# EAGLE schematic ESP Breakout Adapter - v2_0B - SPX3819 (EAGLE 7.3.0)
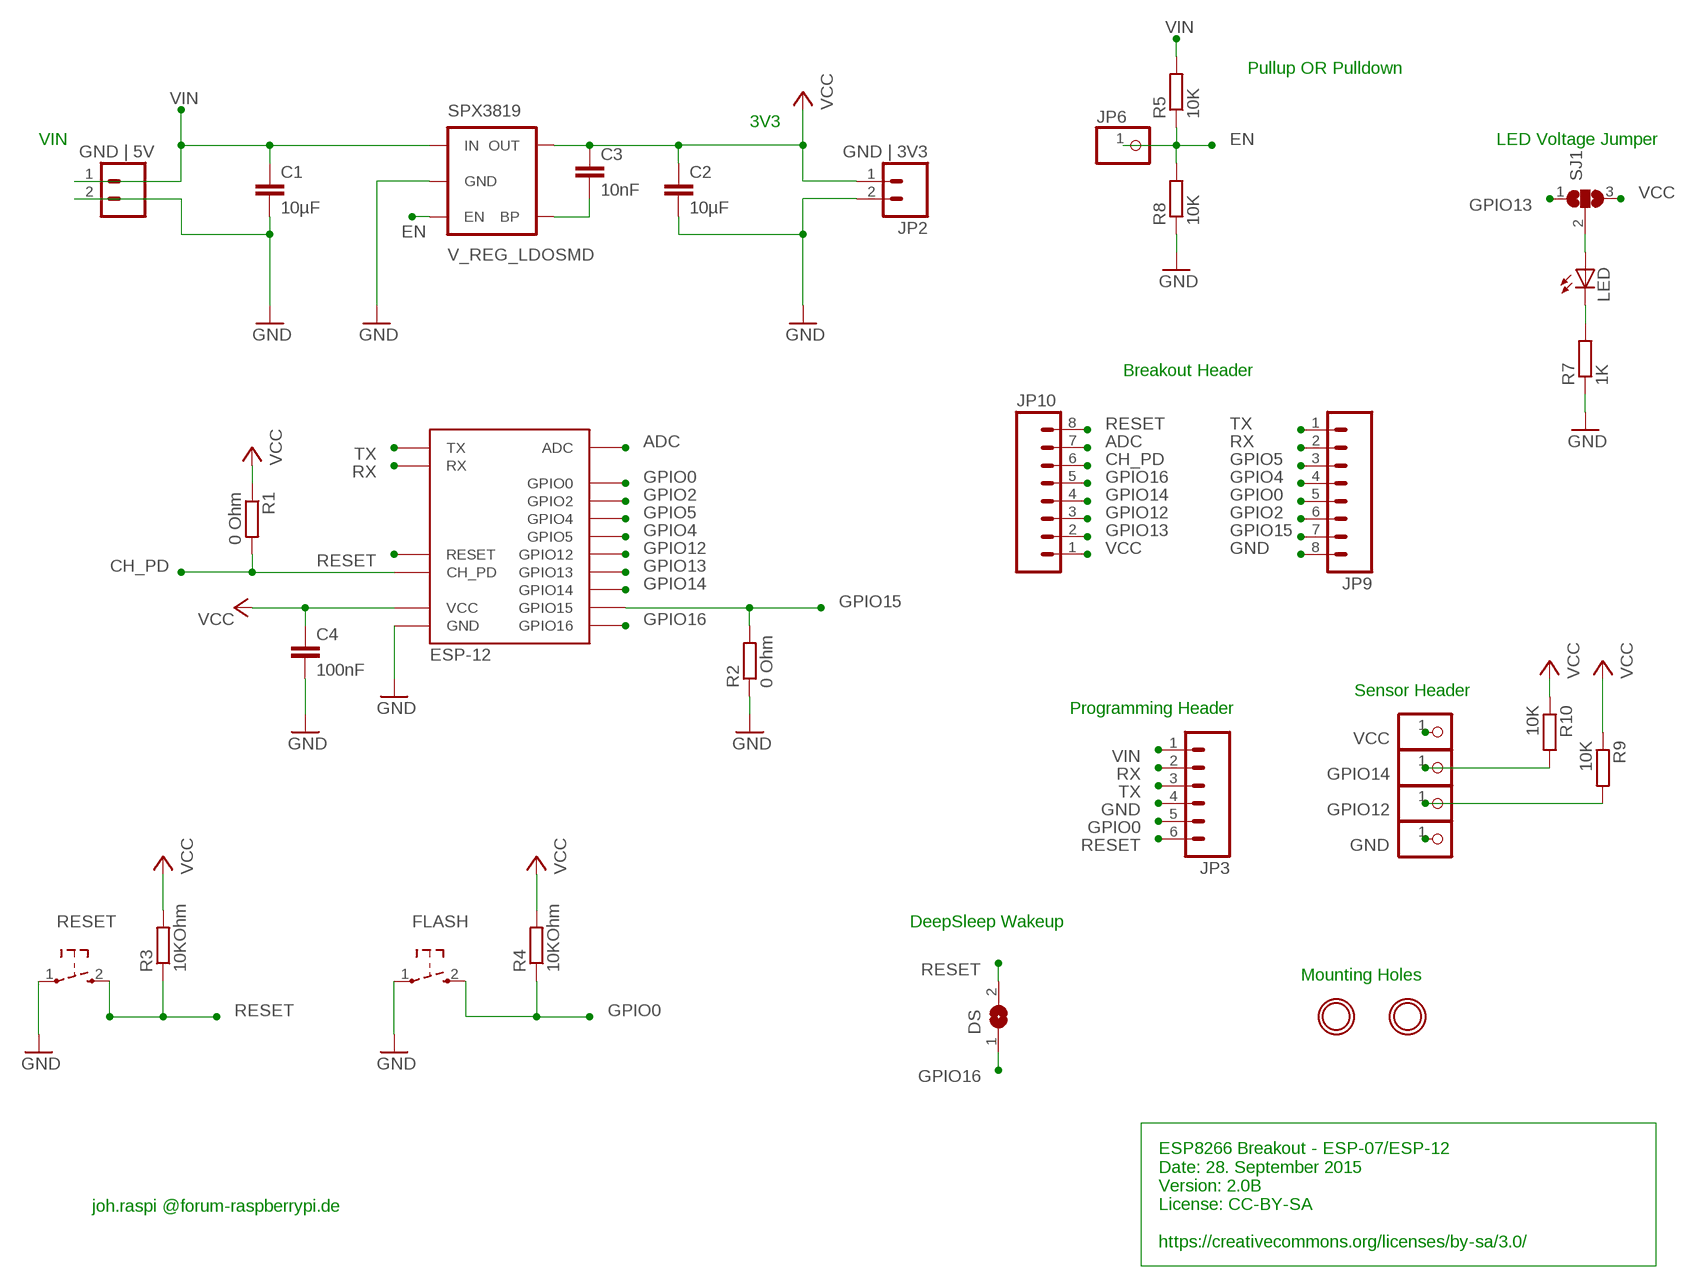
[diagram p0: schematic, sheet 1]

## Parts
C1  10µF  C-EUC1206  [C1206]
C2  10µF  C-EUC1206  [C1206]
C3  10nF  C-EUC0603K  [C0603K]
C4  100nF  C-EUC0805  [C0805]
DS  SJ  [SJ]
FLASH  SW_TACT_2P-3X6  [SW_TACT_3X6]
JP1  GND | 5V  M02PTH  [1X02]
JP2  GND | 3V3  M02PTH  [1X02]
JP3  M06SIP  [1X06]
JP4  PINHD-1X1  [1X01]
JP6  PINHD-1X1  [1X01]
JP7  PINHD-1X1  [1X01]
JP8  PINHD-1X1  [1X01]
JP9  M081X08  [1X08]
JP10  M081X08  [1X08]
JP11  PINHD-1X1  [1X01]
LED  LED-0805  [LED-805]
R1  0 Ohm  R-EU_R0805  [R0805]
R2  0 Ohm  R-EU_R0805  [R0805]
R3  10KOhm  R-EU_R0805  [R0805]
R4  10KOhm  R-EU_R0805  [R0805]
R5  10K  R-EU_R0805  [R0805]
R7  1K  R-EU_R0805  [R0805]
R8  10K  R-EU_R0805  [R0805]
R9  10K  R-EU_R0805  [R0805]
R10  10K  R-EU_R0805  [R0805]
RESET  SW_TACT_2P-3X6  [SW_TACT_3X6]
SJ1  SJ2W  [SJ_2]
SPX3819  V_REG_LDOSMD  [SOT23-5]
U$1  ESP-12  [ESP-12]
U$4  MOUNTINGHOLE2.0  [MOUNTINGHOLE_2.0_PLATED]
U$5  MOUNTINGHOLE2.0  [MOUNTINGHOLE_2.0_PLATED]

## Nets
ADC: JP10.7 U$1.ADC
CH_PD: JP10.6 R1.2 U$1.CH_PD
EN: JP6.1 R5.1 R8.2 SPX3819.3(EN)
GND [a]: C1.2 C2.2 C4.2 FLASH.1 JP1.2 JP2.2 JP3.4 JP4.1 JP9.8 R2.1 R7.1 R8.1 RESET.1 SPX3819.2(GND) U$1.GND
GPIO0: FLASH.2 JP3.5 JP9.5 R4.1 U$1.GPIO0
GPIO2: JP9.6 U$1.GPIO2
GPIO4: JP9.4 U$1.GPIO5
GPIO5: JP9.3 U$1.GPIO4
GPIO12: JP7.1 JP10.3 R9.2 U$1.GPIO12
GPIO13: JP10.2 SJ1.1 U$1.GPIO13
GPIO14: JP10.4 JP11.1 R10.2 U$1.GPIO14
GPIO15: JP9.7 R2.2 U$1.GPIO15
GPIO16: DS.1 JP10.5 U$1.GPIO16
N$3: LED.C R7.2
N$4: LED.A SJ1.2
RESET: DS.2 JP3.6 JP10.8 R3.1 RESET.2 U$1.RESET
RX: JP3.2 JP9.2 U$1.RX
SET/BYP: C3.2 SPX3819.4(BP)
TX: JP3.3 JP9.1 U$1.TX
VCC: C2.1 C3.1 C4.1 JP2.1 JP8.1 JP10.1 R1.1 R3.2 R4.2 R9.1 R10.1 SJ1.3 SPX3819.5(OUT) U$1.VCC
VIN: C1.1 JP1.1 JP3.1 R5.2 SPX3819.1(IN)

## Notes on the sheet
- Pullup OR Pulldown
- 3V3
- VIN | LED Voltage Jumper
- Breakout Header
- Sensor Header
- Programming Header
- DeepSleep Wakeup
- Mounting Holes
- joh.raspi @forum-raspberrypi.de
- ESP8266 Breakout - ESP-07/ESP-12
  Date: 28. September 2015
  Version: 2.0B
  License: CC-BY-SA
  
  https://creativecommons.org/licenses/by-sa/3.0/

## Library data of the parts
C1-C4 = rcl:C-EU: CAPACITOR, European symbol
DS = jumper:SJ: SMD solder JUMPER
FLASH RESET = dp-devices:SW_TACT_2P
JP1 JP2 = SparkFun:M02: Header 2 Standard 2-pin 0.1" header. Use with straight break away headers (SKU : PRT-00116), right angle break away headers (PRT-00553), swiss pins (PRT-00743), machine pins (PRT-00117), and female headers (PRT-00115). Molex polarized connector foot print use with SKU : PRT-08233 with associated crimp pins and housings.
JP3 = SparkFun:M06: Header 6 Standard 6-pin 0.1" header. Use with straight break away headers (SKU : PRT-00116), right angle break away headers (PRT-00553), swiss pins (PRT-00743), machine pins (PRT-00117), and female headers (PRT-00115). Molex polarized connector foot print use with SKU : PRT-08094 with associated crimp pins and housings. NOTES ON THE VARIANTS LOCK and LOCK_LONGPADS... This footprint was designed to help hold the alignment of a through-hole component (i.e. 6-pin header) while soldering it into place. You may notice that each hole has been shifted either up or down by 0.005 of an inch from it's more standard position (which is a perfectly straight line). This slight alteration caused the pins (the squares in the middle) to touch the edges of the holes. Because they are alternating, it causes a "brace" to hold the component in place. 0.005 has proven to be the perfect amount of "off-center" position when using our standard breakaway headers. Although looks a little odd when you look at the bare footprint, once you have a header in there, the alteration is very hard to notice. Also, if you push a header all the way into place, it is covered up entirely on the bottom side. This idea of altering the position of holes to aid alignment will be further integrated into the Sparkfun Library for other footprints. It can help hold any component with 3 or more connection pins.
JP4 JP6-JP8 JP11 = pinhead:PINHD-1X1: PIN HEADER
JP9 JP10 = SparkFun:M08: Header 8 Standard 8-pin 0.1" header. Use with straight break away headers (SKU : PRT-00116), right angle break away headers (PRT-00553), swiss pins (PRT-00743), machine pins (PRT-00117), and female headers (PRT-00115).
LED = dp-devices:LED: Light Emitting Diode
R1-R4 R7 = rcl:R-EU_: RESISTOR, European symbol
R5 R8-R10 = resistor:R-EU_: RESISTOR, European symbol
SJ1 = jumper:SJ2W: SMD solder JUMPER
SPX3819 = SparkFun:V_REG_LDO: Voltage Regulator LDO Standard 150mA LDO voltage regulator in SOT-23 layout. Micrel part MIC5205. BP (by-pass) pin is used to lower output noise with 470pF cap.
U$1 = johs_esp8266_lib_frank_esp12e_mod:ESP-12: ESP8266 Wifi Module ESP-12; DIMENSIONS: 24.0 x 16.0 mm; PINS: 16; PITCH: 0.078" / 2 mm
U$4 U$5 = microbuilder:MOUNTINGHOLE: Mounting Hole For #2 screws (0.086"/2.18mm width, 0.094"/2.4mm hole) use 2.5mm

## Net classes
1 a: width 0.203 mm, drill 0.305 mm, clearance 0.203 mm